# Altium schematic sheet scheme.SchDoc: {Наименование}
size 209 x 297 mm; DocumentNumber: {Обозначение}; SheetNumber: 1; SheetTotal: 4; PageSetup: Record=PageOptions|CenterHorizontal=False|CenterVertical=False|PrintScale=0.95|XCorrection=0.00|YCorrection=0.00|PrintKind=1|BorderSize=5000000|LeftOffset=0|BottomOffset=0|Orientation=1|PaperLength=1000|PaperWidth=1000|Scale=100|PaperSource=15|PrintQuality=600|MediaType=1|DitherType=10|PaperKind=A4|PrintScaleMode=1; Rule: PcbType=ProtelPcb
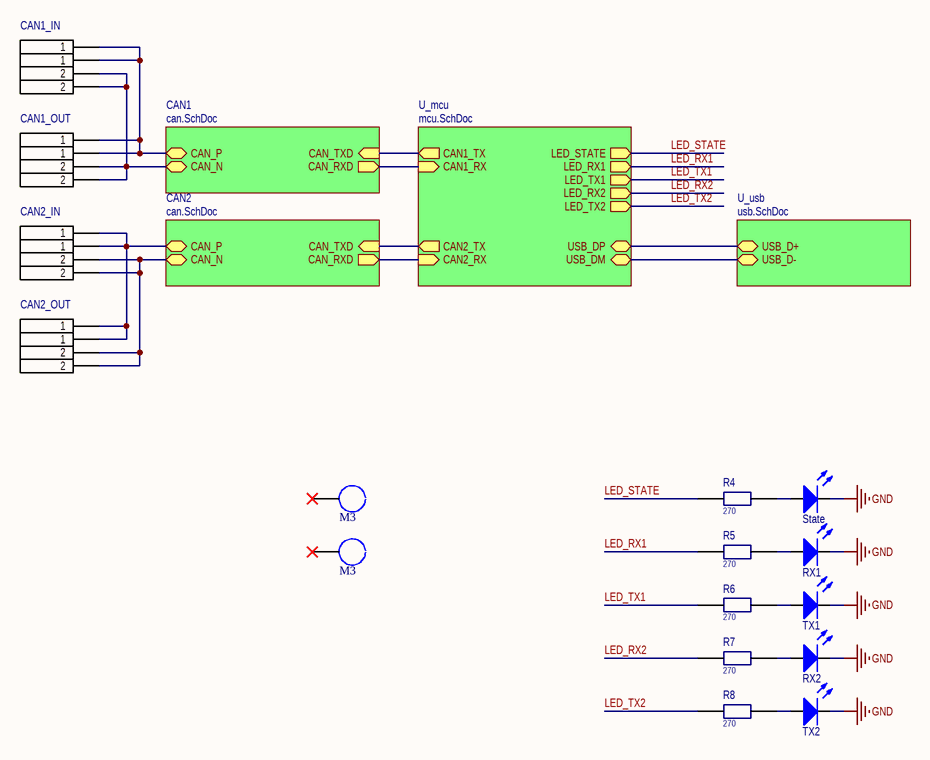
[diagram p0: scheme.SchDoc]

## Parts
*1  M3  [M3]  (no BOM)
*2  M3  [M3]  (no BOM)
CAN1_IN  TBLH10-350-02BK  [CUI_TBLH10-350-02BK]  (value not drawn)
CAN1_OUT  TBLH10-350-02BK  [CUI_TBLH10-350-02BK]  (value not drawn)
CAN2_IN  TBLH10-350-02BK  [CUI_TBLH10-350-02BK]  (value not drawn)
CAN2_OUT  TBLH10-350-02BK  [CUI_TBLH10-350-02BK]  (value not drawn)
R4  270  [R_0603]
R5  270  [R_0603]
R6  270  [R_0603]
R7  270  [R_0603]
R8  270  [R_0603]
RX1  Red  [LED_0603]  (value not drawn)
RX2  Red  [LED_0603]  (value not drawn)
State  Red  [LED_0603]  (value not drawn)
TX1  Red  [LED_0603]  (value not drawn)
TX2  Red  [LED_0603]  (value not drawn)

## Sub-sheets
CAN1 = can.SchDoc: CAN_RXD (out), CAN_TXD (in), CAN_P (bidir), CAN_N (bidir)
CAN2 = can.SchDoc: CAN_RXD (out), CAN_TXD (in), CAN_P (bidir), CAN_N (bidir)
U_mcu = mcu.SchDoc: LED_STATE (out), LED_RX1 (out), LED_TX1 (out), LED_RX2 (out), LED_TX2 (out), USB_DP (bidir), USB_DM (bidir), CAN1_RX (in), CAN1_TX (out), CAN2_RX (in), CAN2_TX (out)
U_usb = usb.SchDoc: USB_D+ (bidir), USB_D- (bidir)

## Nets
GND: RX1.2(K) RX2.2(K) State.2(K) TX1.2(K) TX2.2(K)
LED_RX1: R5.2 ; sheet U_mcu/LED_RX1
LED_RX2: R7.2 ; sheet U_mcu/LED_RX2
LED_STATE: R4.2 ; sheet U_mcu/LED_STATE
LED_TX1: R6.2 ; sheet U_mcu/LED_TX1
LED_TX2: R8.2 ; sheet U_mcu/LED_TX2
NetCAN1_IN_1_A: CAN1_IN.1_A(1) CAN1_IN.1_B(1) CAN1_OUT.1_A(1) CAN1_OUT.1_B(1) ; sheet CAN1/CAN_P
NetCAN1_IN_2_A: CAN1_IN.2_A(2) CAN1_IN.2_B(2) CAN1_OUT.2_A(2) CAN1_OUT.2_B(2) ; sheet CAN1/CAN_N
NetCAN2_IN_1_A: CAN2_IN.1_A(1) CAN2_IN.1_B(1) CAN2_OUT.1_A(1) CAN2_OUT.1_B(1) ; sheet CAN2/CAN_P
NetCAN2_IN_2_A: CAN2_IN.2_A(2) CAN2_IN.2_B(2) CAN2_OUT.2_A(2) CAN2_OUT.2_B(2) ; sheet CAN2/CAN_N
NetR4_1: R4.1 State.1(A)
NetR5_1: R5.1 RX1.1(A)
NetR6_1: R6.1 TX1.1(A)
NetR7_1: R7.1 RX2.1(A)
NetR8_1: R8.1 TX2.1(A)
(unnamed): sheet U_mcu/USB_DP, sheet U_usb/USB_D+
(unnamed): sheet U_mcu/USB_DM, sheet U_usb/USB_D-
(unnamed): sheet U_mcu/CAN1_RX, sheet CAN1/CAN_RXD
(unnamed): sheet U_mcu/CAN1_TX, sheet CAN1/CAN_TXD
(unnamed): sheet U_mcu/CAN2_RX, sheet CAN2/CAN_RXD
(unnamed): sheet U_mcu/CAN2_TX, sheet CAN2/CAN_TXD

Not connected (* = marked no-connect by the designer): *1 1*; *2 1*

## Notes on the sheet
- Подп. и дата
- Инв. № дубл.
- Взам. инв. №
- Инв. № подл.
- Лист
- Изм.
- № докум.
- Подп.
- Дата

## Library data of the parts
CAN1_IN = TBLH10-350-02BK: Alternative Part: JILN JL212R-35002B01; Package: None; Part Number: TBLH10-350-02BK; Price: None; Value: *; Availability: Unavailable
R4-R8 = RES_SMD: Resistor; Part Number: RC0603FR-07270RL; Alternative Part: *; Value: 270
RX1 RX2 = LED_SMT_0603: LED; Part Number: GNL-0603SGC; Value: *; Color: Red
State = LED_SMT_0603: LED; Part Number: GNL-0603SRC; Value: *; Color: Red
TX1 TX2 = LED_SMT_0603: LED; Part Number: GNL-0603SBC; Value: *; Color: Red
CAN1_OUT CAN2_IN CAN2_OUT = TBLH10-350-02BK: Package: None; Part Number: TBLH10-350-02BK; Price: None; Value: *; Availability: Unavailable; Alternative Part: *